# Altium project Battery Management System.PrjPcb
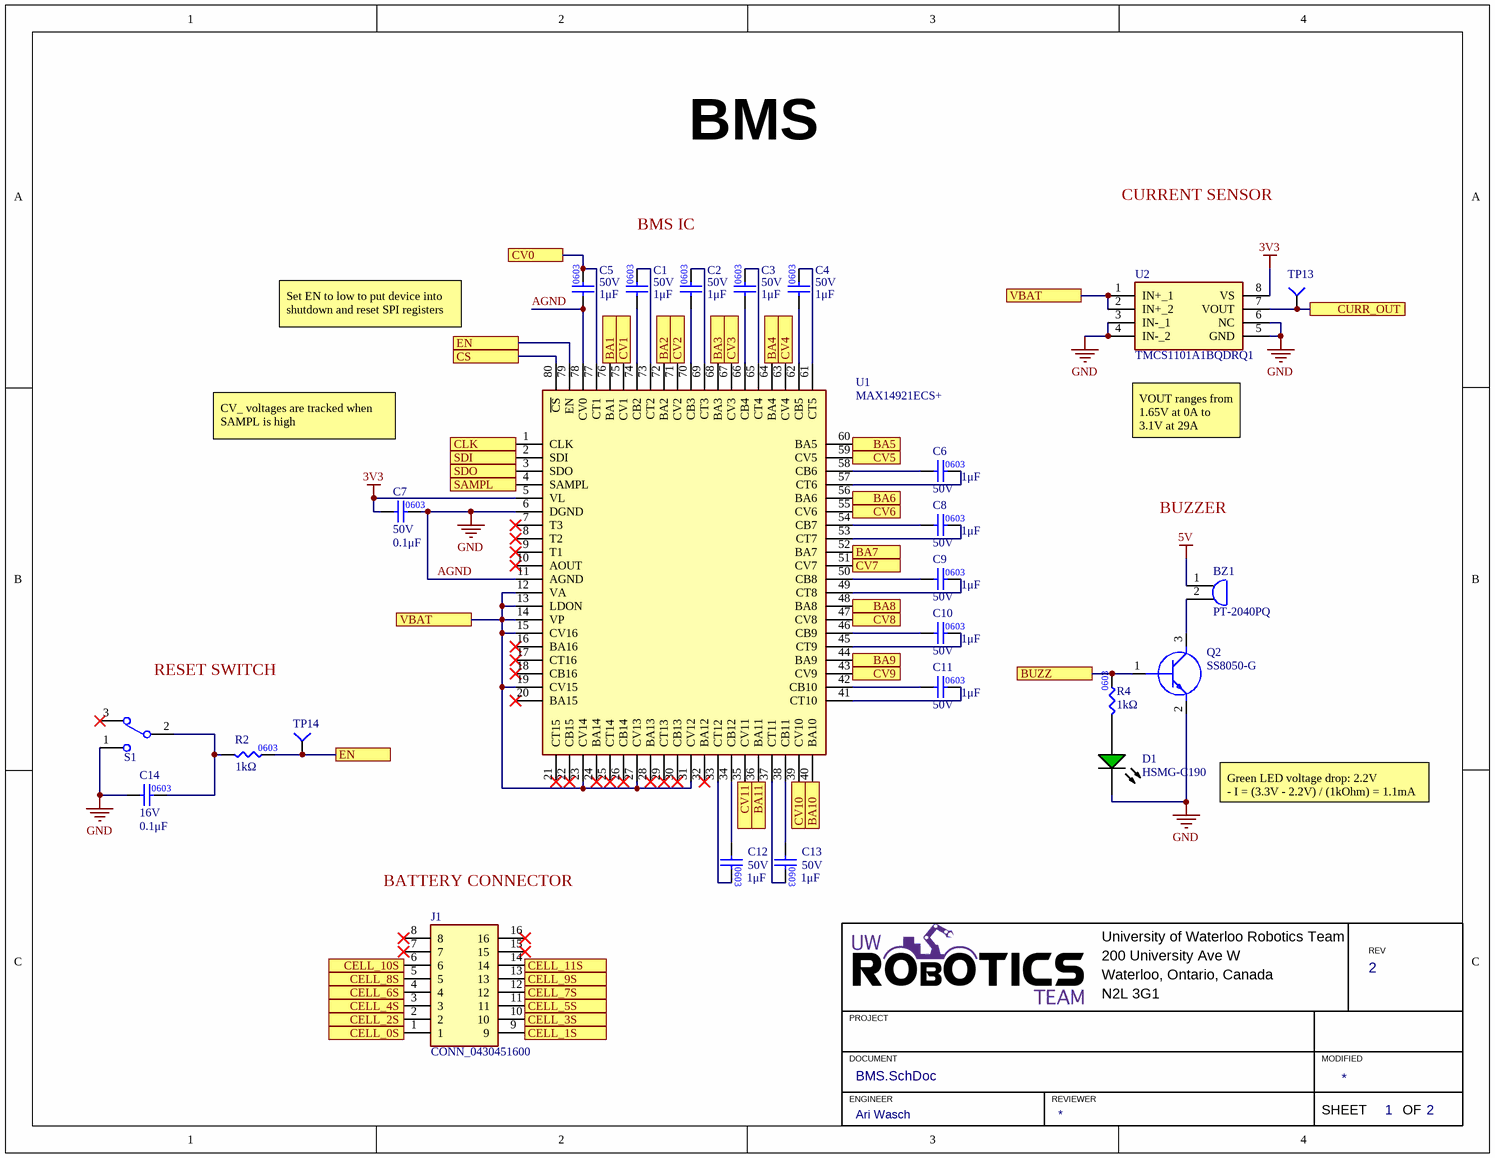
[diagram p0: BMS.SchDoc]
2 sheets, 70 parts. Net scope: flat (ports and power ports of the same name join across sheets).
Sheets:
  BMS.SchDoc
  BatteryBalancing.SchDoc

## Sheet BMS.SchDoc: BMS
size 279 x 215 mm; Engineer: Ari Wasch; Revision: 2; SheetNumber: 1; SheetTotal: 2

### Parts
BZ1  PT-2040PQ  [PT2040PQ]
C1  value 1μF  Voltage Rating: 50V  [CAP0603]  (hidden comment: CAP_1uF_50V_0603)
C2  value 1μF  Voltage Rating: 50V  [CAP0603]  (hidden comment: CAP_1uF_50V_0603)
C3  value 1μF  Voltage Rating: 50V  [CAP0603]  (hidden comment: CAP_1uF_50V_0603)
C4  value 1μF  Voltage Rating: 50V  [CAP0603]  (hidden comment: CAP_1uF_50V_0603)
C5  value 1μF  Voltage Rating: 50V  [CAP0603]  (hidden comment: CAP_1uF_50V_0603)
C6  value 1μF  Voltage Rating: 50V  [CAP0603]  (hidden comment: CAP_1uF_50V_0603)
C7  value 0.1μF  Voltage Rating: 50V  [CAP0603]  (hidden comment: CAP_0.1uF_50V_0603)
C8  value 1μF  Voltage Rating: 50V  [CAP0603]  (hidden comment: CAP_1uF_50V_0603)
C9  value 1μF  Voltage Rating: 50V  [CAP0603]  (hidden comment: CAP_1uF_50V_0603)
C10  value 1μF  Voltage Rating: 50V  [CAP0603]  (hidden comment: CAP_1uF_50V_0603)
C11  value 1μF  Voltage Rating: 50V  [CAP0603]  (hidden comment: CAP_1uF_50V_0603)
C12  value 1μF  Voltage Rating: 50V  [CAP0603]  (hidden comment: CAP_1uF_50V_0603)
C13  value 1μF  Voltage Rating: 50V  [CAP0603]  (hidden comment: CAP_1uF_50V_0603)
C14  value 0.1μF  Voltage Rating: 16V  [CAP0603]  (hidden comment: CAP_0.1uF_16V_0603)
D1  HSMG-C190  [AVAG-HSMX-C190_V]
J1  CONN_0430451600  [0430451600]
Q2  Manufacturer_Part_Number: SS8050-G  [SOT23-3]  (hidden comment: NPN_40V_1.5A)
R2  value 1kΩ  [RES0603]  (hidden comment: RES_1kΩ_0603_5%)
R4  value 1kΩ  [RES0603]  (hidden comment: RES_1kΩ_0603_5%)
S1  SW_TOGGLE_SPDT  [100SP1T1B4M2QE]  (value not drawn)
TP13  TESTPOINT_1MM_SQUARE  [TESTPOINT_SQUARE_1MM]  (value not drawn)  (no BOM)
TP14  TESTPOINT_1MM_SQUARE  [TESTPOINT_SQUARE_1MM]  (value not drawn)  (no BOM)
U1  MAX14921ECS+  [QFP50P1400X1400X120-80N]
U2  TMCS1101A1BQDRQ1  [SOIC127P600X175-8N]

### Ports
BA1, BA2, BA3, BA4, BA5, BA6, BA7, BA8, BA9, BA10, BA11, BUZZ, CELL_0S, CELL_1S, CELL_2S, CELL_3S, CELL_4S, CELL_5S, CELL_6S, CELL_7S, CELL_8S, CELL_9S, CELL_10S, CELL_11S, CLK, CS, CURR_OUT, CV0, CV1, CV2, CV3, CV4, CV5, CV6, CV7, CV8, CV9, CV10, CV11, EN, SAMPL, SDI, SDO, VBAT

### Nets
3V3: C7.1 U1.5(VL) U2.8(VS)
5V: BZ1.1
AGND: C5.1 C5.2 C7.2 C14.1 D1.2(K) J1.1 Q2.2(E) S1.1 U1.6(DGND) U1.11(AGND) U1.77(CT1) U1.78(CV0) U2.3(IN-_1) U2.4(IN-_2) U2.5(GND) U2.6(NC) ; port CELL_0S, port CV0  [also labelled GND]
NetBZ1_2: BZ1.2 Q2.3(C)
NetC1_1: C1.1 U1.74(CB2)
NetC1_2: C1.2 U1.73(CT2)
NetC2_1: C2.1 U1.70(CB3)
NetC2_2: C2.2 U1.69(CT3)
NetC3_1: C3.1 U1.66(CB4)
NetC3_2: C3.2 U1.65(CT4)
NetC4_1: C4.1 U1.62(CB5)
NetC4_2: C4.2 U1.61(CT5)
NetC6_1: C6.1 U1.58(CB6)
NetC6_2: C6.2 U1.57(CT6)
NetC8_1: C8.1 U1.54(CB7)
NetC8_2: C8.2 U1.53(CT7)
NetC9_1: C9.1 U1.50(CB8)
NetC9_2: C9.2 U1.49(CT8)
NetC10_1: C10.1 U1.46(CB9)
NetC10_2: C10.2 U1.45(CT9)
NetC11_1: C11.1 U1.42(CB10)
NetC11_2: C11.2 U1.41(CT10)
NetC12_1: C12.1 U1.34(CB12)
NetC12_2: C12.2 U1.33(CT12)
NetC13_1: C13.1 U1.38(CB11)
NetC13_2: C13.2 U1.37(CT11)
NetC14_2: C14.2 R2.1 S1.2
NetD1_1: D1.1(A) R4.1
NetJ1_2: J1.2 ; port CELL_2S
NetJ1_3: J1.3 ; port CELL_4S
NetJ1_4: J1.4 ; port CELL_6S
NetJ1_5: J1.5 ; port CELL_8S
NetJ1_6: J1.6 ; port CELL_10S
NetJ1_9: J1.9 ; port CELL_1S
NetJ1_10: J1.10 ; port CELL_3S
NetJ1_11: J1.11 ; port CELL_5S
NetJ1_12: J1.12 ; port CELL_7S
NetJ1_13: J1.13 ; port CELL_9S
NetJ1_14: J1.14 ; port CELL_11S
NetQ1_1: U1.60(BA5) ; port BA5
NetQ2_1: Q2.1(B) R4.2 ; port BUZZ
NetQ3_1: U1.64(BA4) ; port BA4
NetQ4_1: U1.36(BA11) ; port BA11
NetQ5_1: U1.40(BA10) ; port BA10
NetQ6_1: U1.68(BA3) ; port BA3
NetQ7_1: U1.44(BA9) ; port BA9
NetQ8_1: U1.72(BA2) ; port BA2
NetQ9_1: U1.48(BA8) ; port BA8
NetQ10_1: U1.76(BA1) ; port BA1
NetQ11_1: U1.52(BA7) ; port BA7
NetQ12_1: U1.56(BA6) ; port BA6
NetR1_2: U1.59(CV5) ; port CV5
NetR2_2: R2.2 TP14.1(=value) U1.79(EN) ; port EN
NetR5_2: U1.63(CV4) ; port CV4
NetR6_2: U1.35(CV11) ; port CV11
NetR9_2: U1.39(CV10) ; port CV10
NetR10_2: U1.67(CV3) ; port CV3
NetR13_2: U1.43(CV9) ; port CV9
NetR14_2: U1.71(CV2) ; port CV2
NetR17_2: U1.47(CV8) ; port CV8
NetR18_2: U1.75(CV1) ; port CV1
NetR21_2: U1.51(CV7) ; port CV7
NetR23_2: U1.55(CV6) ; port CV6
NetTP13_1: TP13.1(=value) U2.7(VOUT) ; port CURR_OUT
NetU1_1: U1.1(CLK) ; port CLK
NetU1_2: U1.2(SDI) ; port SDI
NetU1_3: U1.3(SDO) ; port SDO
NetU1_4: U1.4(SAMPL) ; port SAMPL
NetU1_12: U1.12(VA) U1.13(LDON) U1.14(VP) U1.15(CV16) U1.19(CV15) U1.23(CV14) U1.27(CV13) U1.31(CV12) U2.1(IN+_1) U2.2(IN+_2) ; port VBAT
NetU1_80: U1.80(~{CS}) ; port CS

Not connected (* = marked no-connect by the designer): J1 7* 8* 15* 16*; S1 3*; U1 7(T3)* 8(T2)* 9(T1)* 10(AOUT)* 16(BA16)* 17(CT16)* 18(CB16)* 20(BA15)* 21(CT15)* 22(CB15)* 24(BA14)* 25(CT14)* 26(CB14)* 28(BA13)* 29(CT13)* 30(CB13)* 32(BA12)*

### Notes on the sheet
- BMS IC
- CURRENT SENSOR
- Set EN to low to put device into shutdown and reset SPI registers
- CV_ voltages are tracked when SAMPL is high
- (near U2) VOUT ranges from 1.65V at 0A to 3.1V at 29A
- BUZZER
- (near S1) RESET SWITCH
- Green LED voltage drop: 2.2V
  - I = (3.3V - 2.2V) / (1kOhm) = 1.1mA
- (near J1) BATTERY CONNECTOR
- University of Waterloo Robotics Team
- 200 University Ave W
- REV
- PROJECT
- Waterloo, Ontario, Canada
- N2L 3G1
- DOCUMENT
- ENGINEER
- REVIEWER
- MODIFIED
- SHEET
- OF
- (in symbol CAP_1uF_50V_0603) 0603

### Library data of the parts
BZ1 = PT-2040PQ: Loudspeaker or Buzzer; Manufacturer_Name: Mallory Sonalert; Datasheet Link: https://datasheet.datasheetarchive.com/originals/distributors/SFDatasheet-1/sf-00027599.pdf; Height: 9.4mm; Manufacturer_Part_Number: PT-2040PQ; Mouser Part Number: 539-PT2040PQ; Mouser Price/Stock: https://www.mouser.co.uk/ProductDetail/Mallory-Sonalert/PT-2040PQ?qs=l%2Fkuw%2F8%252BD9j2AVf7eGaf%252BA%3D%3D
C1-C6 C8-C13 = CAP_1uF_50V_0603: CAP CER 1UF 50V X6S 0603; Manufacturer Part Number 1: C1608X6S1H105K080AC; Manufacturer 1: TDK Corporation; Supplier Part Number 1: 445-7424-1-ND; Supplier 1: Digi-Key; Dielectric: X6S
C7 = CAP_0.1uF_50V_0603: CAP CER 0.1UF 50V X7R 0603; Manufacturer Part Number 1: CC0603KRX7R9BB104; Manufacturer 1: Yageo; Package/Footprint: 0603; Supplier Part Number 1: 311-1344-1-ND; Supplier 1: Digi-Key; Mounting Type: SMD; Dielectric: X7R
C14 = CAP_0.1uF_16V_0603: CAP CER 0.1UF 16V X7R 0603; Manufacturer Part Number 1: CC0603KRX7R7BB104; Manufacturer 1: Yageo; Package/Footprint: 0603; Supplier Part Number 1: 311-1088-1-ND; Supplier 1: Digi-Key; Dielectric: X7R; LCSC Number: C108079
D1 = CMP-1744-00002-1: Chip LED, Green, 2.2 V, -40 to 85 degC, 2-Pin SMD, RoHS, Tape and Reel; Frequency: 400 KHz; Max Supply Voltage: 5.5 V; Access Time: 3500 ns; Clock Frequency: 100 KHz; Case\Package: SOIC; Density: 32 kb; Nominal Supply Current: 2 mA; Interface: Serial; Min Supply Voltage: 1.7 V; Packaging: Tape and Reel; PackageReference: HSMX-C190; ComponentLink2URL: http://docs.avagotech.com/docs/AV02-0551EN; RoHSCompliant: true; Pins: 8; REACH SVHC: No SVHC; Max Operating Temperature: 85 degC; Width: 4 mm; Radiation Hardening: No; Package Quantity: 3000; ComponentLink3Description: Package Specification; ComponentLink1Description: Manufacturer URL; Min Operating Temperature: -40 degC; PackageDescription: 2-Pin Surface Mount Device, Body 1.6 x 0.8 mm, Height 0.9 mm; Max Clock Frequency: 100 KHz; Height: 1.5 mm; ComponentLink1URL: http://www.avagotech.com/; DatasheetVersion: Mar-12; ComponentLink2Description: Datasheet; Mount: Surface Mount; Length: 5 mm; ComponentLink3URL: http://www.fairchildsemi.com/dwg/MA/MA03D.pdf; LCSC Number: C188729
J1 = CONN_0430451600: Connector 16 Pin AJX; Manufacturer_Name: Molex; Datasheet Link: https://www.molex.com/pdm_docs/sd/430451600_sd.pdf; Height: 9.02mm; Manufacturer_Part_Number: 0430451600; Arrow Part Number: 0430451600; Arrow Price/Stock: https://www.arrow.com/en/products/0430451600/molex
Q2 = NPN_40V_1.5A: TRANS NPN 40V 1.5A SOT23; Manufacturer_Name: Comchip Technology; Datasheet Link: https://datasheet.datasheetarchive.com/originals/distributors/DKDS-12/229454.pdf; Height: 1.15mm; Mouser Part Number: 750-SS8050-G; Mouser Price/Stock: https://www.mouser.co.uk/ProductDetail/Comchip-Technology/SS8050-G?qs=LLUE9lz1YbcHg%252BWLMAtcrQ%3D%3D; Arrow Part Number: SS8050-G; Arrow Price/Stock: https://www.arrow.com/en/products/ss8050-g/comchip-technology?region=nac
R2 R4 = RES_1kΩ_0603_5%: RES 1K OHM 5% 1/10W 0603; Manufacturer 1: Yageo; Manufacturer Part Number 1: RC0603JR-071KL; Package/Footprint: 0603; Supplier Part Number 1: 311-1.0KGRCT-ND; Supplier 1: Digi-Key; Mounting Type: SMD; LCSC Number: C14676
S1 = SW_TOGGLE_SPDT: SWITCH TOGGLE SPDT 5A 120V; Manufacturer 1: E-Switch; Voltage Rating (DC): 28V; Package/Footprint: TH; Supplier 1: Digi-Key; Mounting Type: TH; Throw Configuration: SPDT; Supplier Part Number 1: EG2355-ND; Manufacturer Part Number 1: 100SP1T1B4M2QE
TP13 = TESTPOINT_1MM_SQUARE: CURR_OUT
TP14 = TESTPOINT_1MM_SQUARE: TESTPOINT 1MM SQUARE
U1 = MAX14921ECS+: IC 16s BMS; Manufacturer_Name: Maxim Integrated; Datasheet Link: http://pdfserv.maximintegrated.com/package_dwgs/21-0072.PDF; Height: 1.2mm; Manufacturer_Part_Number: MAX14921ECS+; Mouser Part Number: 700-MAX14921ECS+; Mouser Price/Stock: https://www.mouser.co.uk/ProductDetail/Maxim-Integrated/MAX14921ECS%2b?qs=Vwh6e7toGLhlnKi5DjCusg%3D%3D
U2 = TMCS1101A1BQDRQ1: Hall-Effect Current Sensor; Manufacturer_Name: Texas Instruments; Datasheet Link: https://www.ti.com/lit/ds/symlink/tmcs1101-q1.pdf?HQS=dis-dk-null-digikeymode-dsf-pf-null-wwe&ts=1636812075055&ref_url=https%253A%252F%252Fwww.digikey.be%252F; Height: 1.75mm; Manufacturer_Part_Number: TMCS1101A1BQDRQ1; Mouser Part Number: 595-TMCS1101A3BQDRQ1; Mouser Price/Stock: https://www.mouser.co.uk/ProductDetail/Texas-Instruments/TMCS1101A3BQDRQ1?qs=QNEnbhJQKvb740%252BlrUS3Og%3D%3D; Arrow Part Number: TMCS1101A3BQDRQ1; Arrow Price/Stock: https://www.arrow.com/en/products/tmcs1101a3bqdrq1/texas-instruments?region=nac

## Sheet BatteryBalancing.SchDoc: Active Cell Balancing Circuit
size 279 x 215 mm; Engineer: Ari Wasch; Revision: 2; SheetNumber: 2; SheetTotal: 2
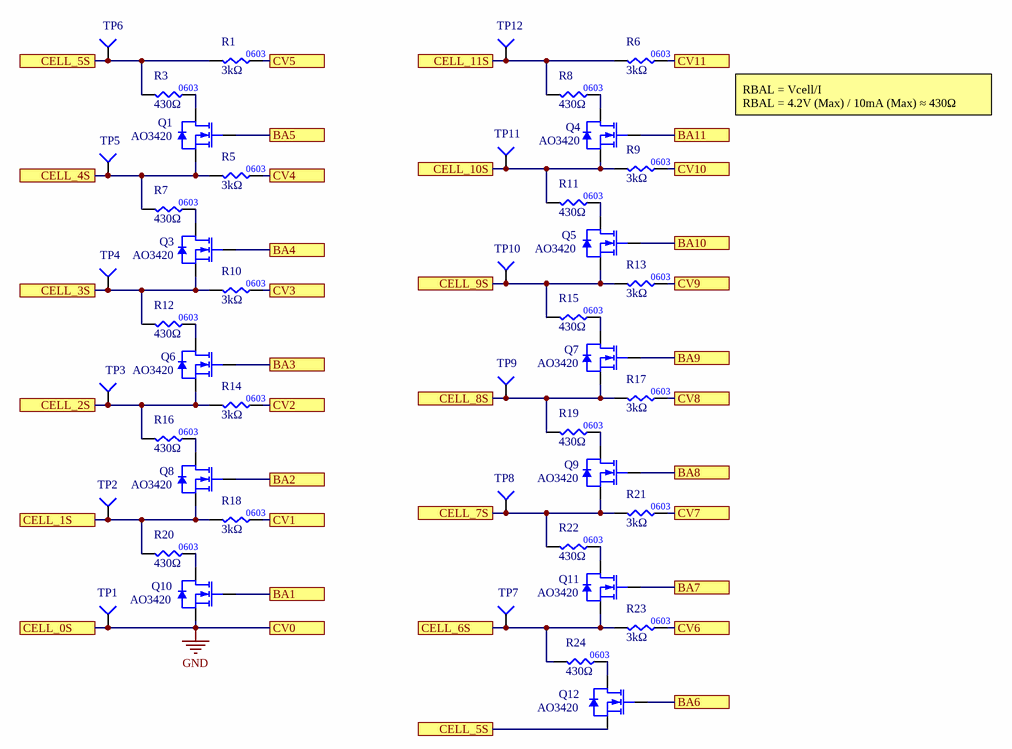
[diagram p1: BatteryBalancing.SchDoc]

### Parts
Q1  Manufacturer Part Number 1: AO3420  [SOT23-3]  (hidden comment: NMOS_20V_6A)
Q3  Manufacturer Part Number 1: AO3420  [SOT23-3]  (hidden comment: NMOS_20V_6A)
Q4  Manufacturer Part Number 1: AO3420  [SOT23-3]  (hidden comment: NMOS_20V_6A)
Q5  Manufacturer Part Number 1: AO3420  [SOT23-3]  (hidden comment: NMOS_20V_6A)
Q6  Manufacturer Part Number 1: AO3420  [SOT23-3]  (hidden comment: NMOS_20V_6A)
Q7  Manufacturer Part Number 1: AO3420  [SOT23-3]  (hidden comment: NMOS_20V_6A)
Q8  Manufacturer Part Number 1: AO3420  [SOT23-3]  (hidden comment: NMOS_20V_6A)
Q9  Manufacturer Part Number 1: AO3420  [SOT23-3]  (hidden comment: NMOS_20V_6A)
Q10  Manufacturer Part Number 1: AO3420  [SOT23-3]  (hidden comment: NMOS_20V_6A)
Q11  Manufacturer Part Number 1: AO3420  [SOT23-3]  (hidden comment: NMOS_20V_6A)
Q12  Manufacturer Part Number 1: AO3420  [SOT23-3]  (hidden comment: NMOS_20V_6A)
R1  value 3kΩ  [RES0603]  (hidden comment: RES_3kΩ_0603_1%)
R3  value 430Ω  [RES0603]  (hidden comment: RES_430Ω_0603_5%)
R5  value 3kΩ  [RES0603]  (hidden comment: RES_3kΩ_0603_1%)
R6  value 3kΩ  [RES0603]  (hidden comment: RES_3kΩ_0603_1%)
R7  value 430Ω  [RES0603]  (hidden comment: RES_430Ω_0603_5%)
R8  value 430Ω  [RES0603]  (hidden comment: RES_430Ω_0603_5%)
R9  value 3kΩ  [RES0603]  (hidden comment: RES_3kΩ_0603_1%)
R10  value 3kΩ  [RES0603]  (hidden comment: RES_3kΩ_0603_1%)
R11  value 430Ω  [RES0603]  (hidden comment: RES_430Ω_0603_5%)
R12  value 430Ω  [RES0603]  (hidden comment: RES_430Ω_0603_5%)
R13  value 3kΩ  [RES0603]  (hidden comment: RES_3kΩ_0603_1%)
R14  value 3kΩ  [RES0603]  (hidden comment: RES_3kΩ_0603_1%)
R15  value 430Ω  [RES0603]  (hidden comment: RES_430Ω_0603_5%)
R16  value 430Ω  [RES0603]  (hidden comment: RES_430Ω_0603_5%)
R17  value 3kΩ  [RES0603]  (hidden comment: RES_3kΩ_0603_1%)
R18  value 3kΩ  [RES0603]  (hidden comment: RES_3kΩ_0603_1%)
R19  value 430Ω  [RES0603]  (hidden comment: RES_430Ω_0603_5%)
R20  value 430Ω  [RES0603]  (hidden comment: RES_430Ω_0603_5%)
R21  value 3kΩ  [RES0603]  (hidden comment: RES_3kΩ_0603_1%)
R22  value 430Ω  [RES0603]  (hidden comment: RES_430Ω_0603_5%)
R23  value 3kΩ  [RES0603]  (hidden comment: RES_3kΩ_0603_1%)
R24  value 430Ω  [RES0603]  (hidden comment: RES_430Ω_0603_5%)
TP1  TESTPOINT_1MM_SQUARE  [TESTPOINT_SQUARE_1MM]  (value not drawn)  (no BOM)
TP2  TESTPOINT_1MM_SQUARE  [TESTPOINT_SQUARE_1MM]  (value not drawn)  (no BOM)
TP3  TESTPOINT_1MM_SQUARE  [TESTPOINT_SQUARE_1MM]  (value not drawn)  (no BOM)
TP4  TESTPOINT_1MM_SQUARE  [TESTPOINT_SQUARE_1MM]  (value not drawn)  (no BOM)
TP5  TESTPOINT_1MM_SQUARE  [TESTPOINT_SQUARE_1MM]  (value not drawn)  (no BOM)
TP6  TESTPOINT_1MM_SQUARE  [TESTPOINT_SQUARE_1MM]  (value not drawn)  (no BOM)
TP7  TESTPOINT_1MM_SQUARE  [TESTPOINT_SQUARE_1MM]  (value not drawn)  (no BOM)
TP8  TESTPOINT_1MM_SQUARE  [TESTPOINT_SQUARE_1MM]  (value not drawn)  (no BOM)
TP9  TESTPOINT_1MM_SQUARE  [TESTPOINT_SQUARE_1MM]  (value not drawn)  (no BOM)
TP10  TESTPOINT_1MM_SQUARE  [TESTPOINT_SQUARE_1MM]  (value not drawn)  (no BOM)
TP11  TESTPOINT_1MM_SQUARE  [TESTPOINT_SQUARE_1MM]  (value not drawn)  (no BOM)
TP12  TESTPOINT_1MM_SQUARE  [TESTPOINT_SQUARE_1MM]  (value not drawn)  (no BOM)

### Ports
BA1, BA2, BA3, BA4, BA5, BA6, BA7, BA8, BA9, BA10, BA11, CELL_0S, CELL_1S, CELL_2S, CELL_3S, CELL_4S, CELL_5S, CELL_6S, CELL_7S, CELL_8S, CELL_9S, CELL_10S, CELL_11S, CV0, CV1, CV2, CV3, CV4, CV5, CV6, CV7, CV8, CV9, CV10, CV11

### Nets
GND: Q10.2(SOURCE) TP1.1(=value) ; port CELL_0S, port CV0  [project net AGND]
NetJ1_2: Q6.2(SOURCE) R14.1 R16.1 TP3.1(=value) ; port CELL_2S
NetJ1_3: Q1.2(SOURCE) R5.1 R7.1 TP5.1(=value) ; port CELL_4S
NetJ1_4: Q11.2(SOURCE) R23.1 R24.1 TP7.1(=value) ; port CELL_6S
NetJ1_5: Q7.2(SOURCE) R17.1 R19.1 TP9.1(=value) ; port CELL_8S
NetJ1_6: Q4.2(SOURCE) R9.1 R11.1 TP11.1(=value) ; port CELL_10S
NetJ1_9: Q8.2(SOURCE) R18.1 R20.1 TP2.1(=value) ; port CELL_1S
NetJ1_10: Q3.2(SOURCE) R10.1 R12.1 TP4.1(=value) ; port CELL_3S
NetJ1_11: Q12.2(SOURCE) R1.1 R3.1 TP6.1(=value) ; port CELL_5S
NetJ1_12: Q9.2(SOURCE) R21.1 R22.1 TP8.1(=value) ; port CELL_7S
NetJ1_13: Q5.2(SOURCE) R13.1 R15.1 TP10.1(=value) ; port CELL_9S
NetJ1_14: R6.1 R8.1 TP12.1(=value) ; port CELL_11S
NetQ1_1: Q1.1(GATE) ; port BA5
NetQ1_3: Q1.3(DRAIN) R3.2
NetQ3_1: Q3.1(GATE) ; port BA4
NetQ3_3: Q3.3(DRAIN) R7.2
NetQ4_1: Q4.1(GATE) ; port BA11
NetQ4_3: Q4.3(DRAIN) R8.2
NetQ5_1: Q5.1(GATE) ; port BA10
NetQ5_3: Q5.3(DRAIN) R11.2
NetQ6_1: Q6.1(GATE) ; port BA3
NetQ6_3: Q6.3(DRAIN) R12.2
NetQ7_1: Q7.1(GATE) ; port BA9
NetQ7_3: Q7.3(DRAIN) R15.2
NetQ8_1: Q8.1(GATE) ; port BA2
NetQ8_3: Q8.3(DRAIN) R16.2
NetQ9_1: Q9.1(GATE) ; port BA8
NetQ9_3: Q9.3(DRAIN) R19.2
NetQ10_1: Q10.1(GATE) ; port BA1
NetQ10_3: Q10.3(DRAIN) R20.2
NetQ11_1: Q11.1(GATE) ; port BA7
NetQ11_3: Q11.3(DRAIN) R22.2
NetQ12_1: Q12.1(GATE) ; port BA6
NetQ12_3: Q12.3(DRAIN) R24.2
NetR1_2: R1.2 ; port CV5
NetR5_2: R5.2 ; port CV4
NetR6_2: R6.2 ; port CV11
NetR9_2: R9.2 ; port CV10
NetR10_2: R10.2 ; port CV3
NetR13_2: R13.2 ; port CV9
NetR14_2: R14.2 ; port CV2
NetR17_2: R17.2 ; port CV8
NetR18_2: R18.2 ; port CV1
NetR21_2: R21.2 ; port CV7
NetR23_2: R23.2 ; port CV6

### Notes on the sheet
- RBAL = Vcell/I
  RBAL = 4.2V (Max) / 10mA (Max) ≈ 430Ω
- University of Waterloo Robotics Team
- 200 University Ave W
- REV
- PROJECT
- Waterloo, Ontario, Canada
- N2L 3G1
- DOCUMENT
- ENGINEER
- REVIEWER
- MODIFIED
- SHEET
- OF
- (in symbol RES_3kΩ_0603_1%) 0603

### Library data of the parts
Q1 Q3-Q12 = NMOS_20V_6A: MOSFET N-CH 20V 6A SOT-23; Manufacturer 1: Alpha & Omega; Supplier 1: Digi-Key; Supplier Part Number 1: 785-1014-2-ND
R1 R5 R6 R9 R10 R13 R14 R17 R18 R21 R23 = RES_3kΩ_0603_1%: RES 3K OHM 1% 1/10W 0603; Manufacturer 1: Yageo; Manufacturer Part Number 1: RC0603FR-073KL; Supplier 1: Digi-Key; Supplier Part Number 1: 311-3.00KHRCT-ND
R3 R7 R8 R11 R12 R15 R16 R19 R20 R22 R24 = RES_430Ω_0603_5%: RES 430 OHM 5% 1/10W 0603; Manufacturer 1: Stackpole Electronics; Manufacturer Part Number 1: RMCF0603JT430R; Package/Footprint: 0603; Supplier Part Number 1: RMCF0603JT430R; Supplier 1: Digi-Key; Mounting Type: SMD
TP1 = TESTPOINT_1MM_SQUARE: CELL0
TP2 = TESTPOINT_1MM_SQUARE: CELL1
TP3 = TESTPOINT_1MM_SQUARE: CELL2
TP4 = TESTPOINT_1MM_SQUARE: CELL3
TP5 = TESTPOINT_1MM_SQUARE: CELL4
TP6 = TESTPOINT_1MM_SQUARE: CELL5
TP7 = TESTPOINT_1MM_SQUARE: CELL6
TP8 = TESTPOINT_1MM_SQUARE: CELL7
TP9 = TESTPOINT_1MM_SQUARE: CELL8
TP10 = TESTPOINT_1MM_SQUARE: CELL9
TP11 = TESTPOINT_1MM_SQUARE: CELL10
TP12 = TESTPOINT_1MM_SQUARE: CELL11

## Nets that join several sheets
AGND: BMS (16 pins), BatteryBalancing (Q10.2 TP1.1)
NetJ1_2: BMS (J1.2), BatteryBalancing (Q6.2 R14.1 R16.1 TP3.1)
NetJ1_3: BMS (J1.3), BatteryBalancing (Q1.2 R5.1 R7.1 TP5.1)
NetJ1_4: BMS (J1.4), BatteryBalancing (Q11.2 R23.1 R24.1 TP7.1)
NetJ1_5: BMS (J1.5), BatteryBalancing (Q7.2 R17.1 R19.1 TP9.1)
NetJ1_6: BMS (J1.6), BatteryBalancing (Q4.2 R9.1 R11.1 TP11.1)
NetJ1_9: BMS (J1.9), BatteryBalancing (Q8.2 R18.1 R20.1 TP2.1)
NetJ1_10: BMS (J1.10), BatteryBalancing (Q3.2 R10.1 R12.1 TP4.1)
NetJ1_11: BMS (J1.11), BatteryBalancing (Q12.2 R1.1 R3.1 TP6.1)
NetJ1_12: BMS (J1.12), BatteryBalancing (Q9.2 R21.1 R22.1 TP8.1)
NetJ1_13: BMS (J1.13), BatteryBalancing (Q5.2 R13.1 R15.1 TP10.1)
NetJ1_14: BMS (J1.14), BatteryBalancing (R6.1 R8.1 TP12.1)
NetQ1_1: BMS (U1.60), BatteryBalancing (Q1.1)
NetQ3_1: BMS (U1.64), BatteryBalancing (Q3.1)
NetQ4_1: BMS (U1.36), BatteryBalancing (Q4.1)
NetQ5_1: BMS (U1.40), BatteryBalancing (Q5.1)
NetQ6_1: BMS (U1.68), BatteryBalancing (Q6.1)
NetQ7_1: BMS (U1.44), BatteryBalancing (Q7.1)
NetQ8_1: BMS (U1.72), BatteryBalancing (Q8.1)
NetQ9_1: BMS (U1.48), BatteryBalancing (Q9.1)
NetQ10_1: BMS (U1.76), BatteryBalancing (Q10.1)
NetQ11_1: BMS (U1.52), BatteryBalancing (Q11.1)
NetQ12_1: BMS (U1.56), BatteryBalancing (Q12.1)
NetR1_2: BMS (U1.59), BatteryBalancing (R1.2)
NetR5_2: BMS (U1.63), BatteryBalancing (R5.2)
NetR6_2: BMS (U1.35), BatteryBalancing (R6.2)
NetR9_2: BMS (U1.39), BatteryBalancing (R9.2)
NetR10_2: BMS (U1.67), BatteryBalancing (R10.2)
NetR13_2: BMS (U1.43), BatteryBalancing (R13.2)
NetR14_2: BMS (U1.71), BatteryBalancing (R14.2)
NetR17_2: BMS (U1.47), BatteryBalancing (R17.2)
NetR18_2: BMS (U1.75), BatteryBalancing (R18.2)
NetR21_2: BMS (U1.51), BatteryBalancing (R21.2)
NetR23_2: BMS (U1.55), BatteryBalancing (R23.2)